# EasyEDA schematic Schematic.json

## Sheets
1 BOARD BAWAH: TITLE: BOARD BAWAH; REV: 1.0; Date: 2022-08-04; Sheet: 1/1; Drawn By: Zubair; Company: Universitas Tidar
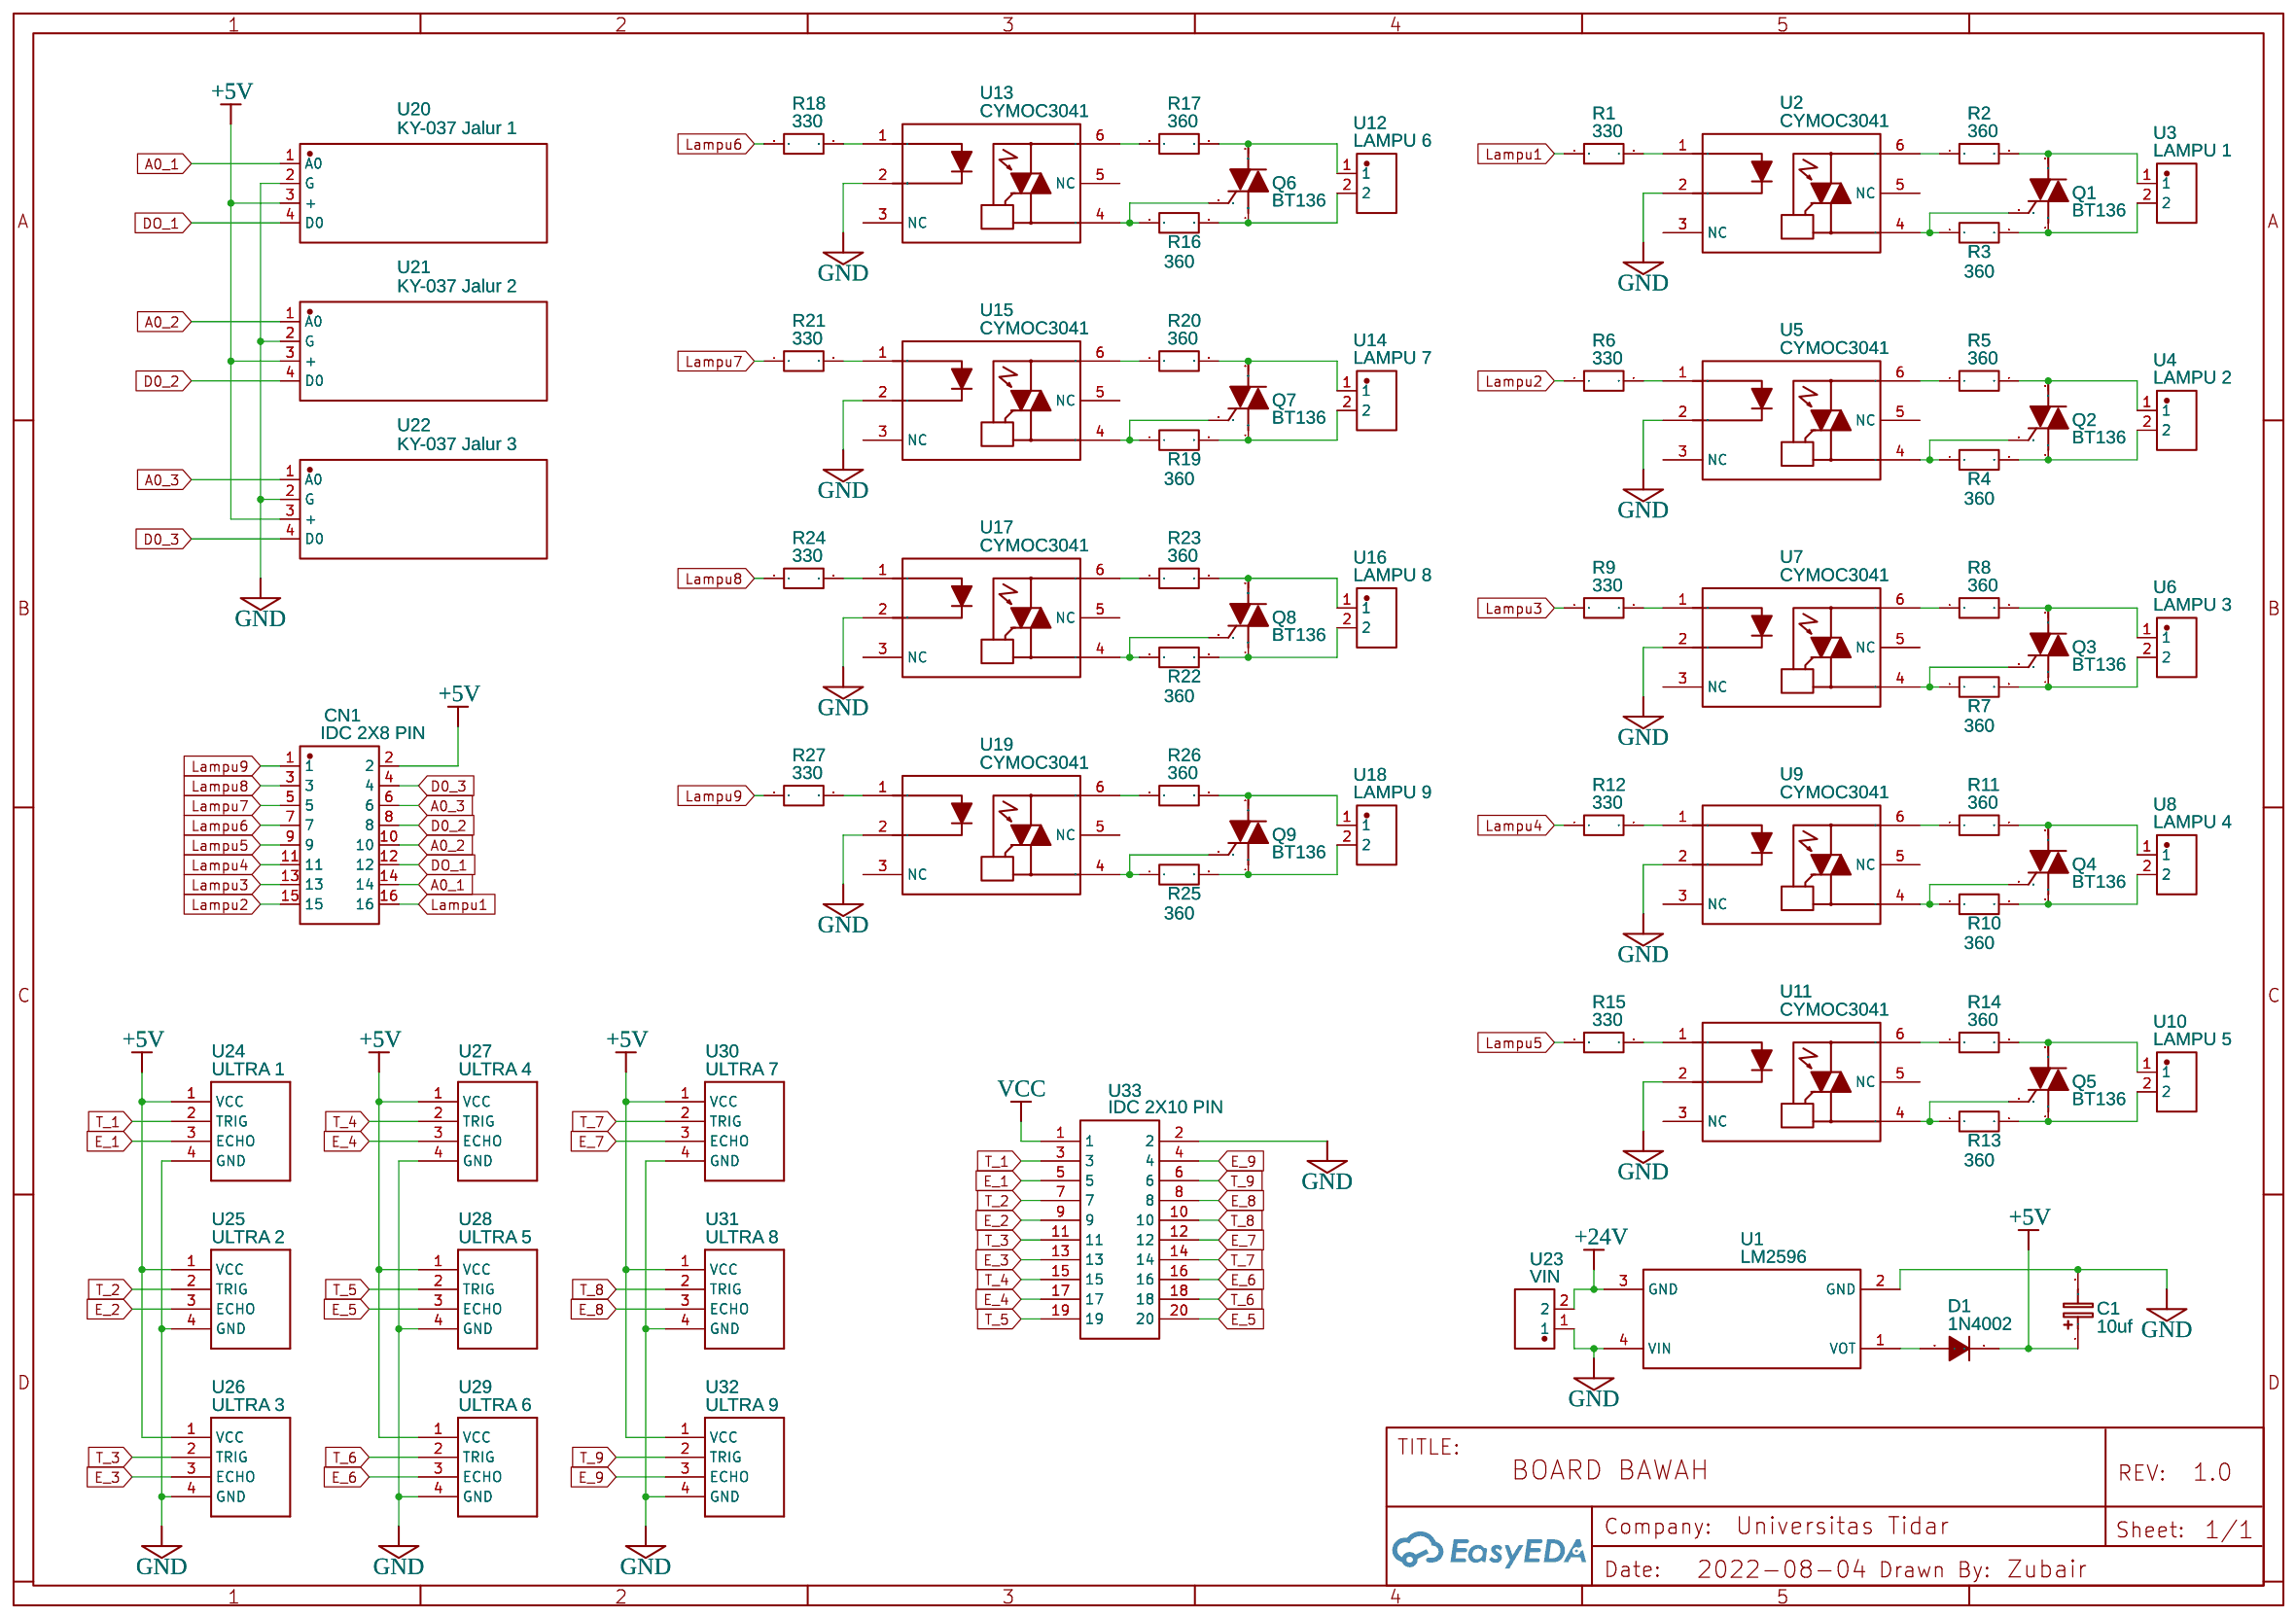
[diagram p0: BOARD BAWAH]
2 BOARD ATAS: TITLE: BOARD ATAS; Date: 2022-09-30
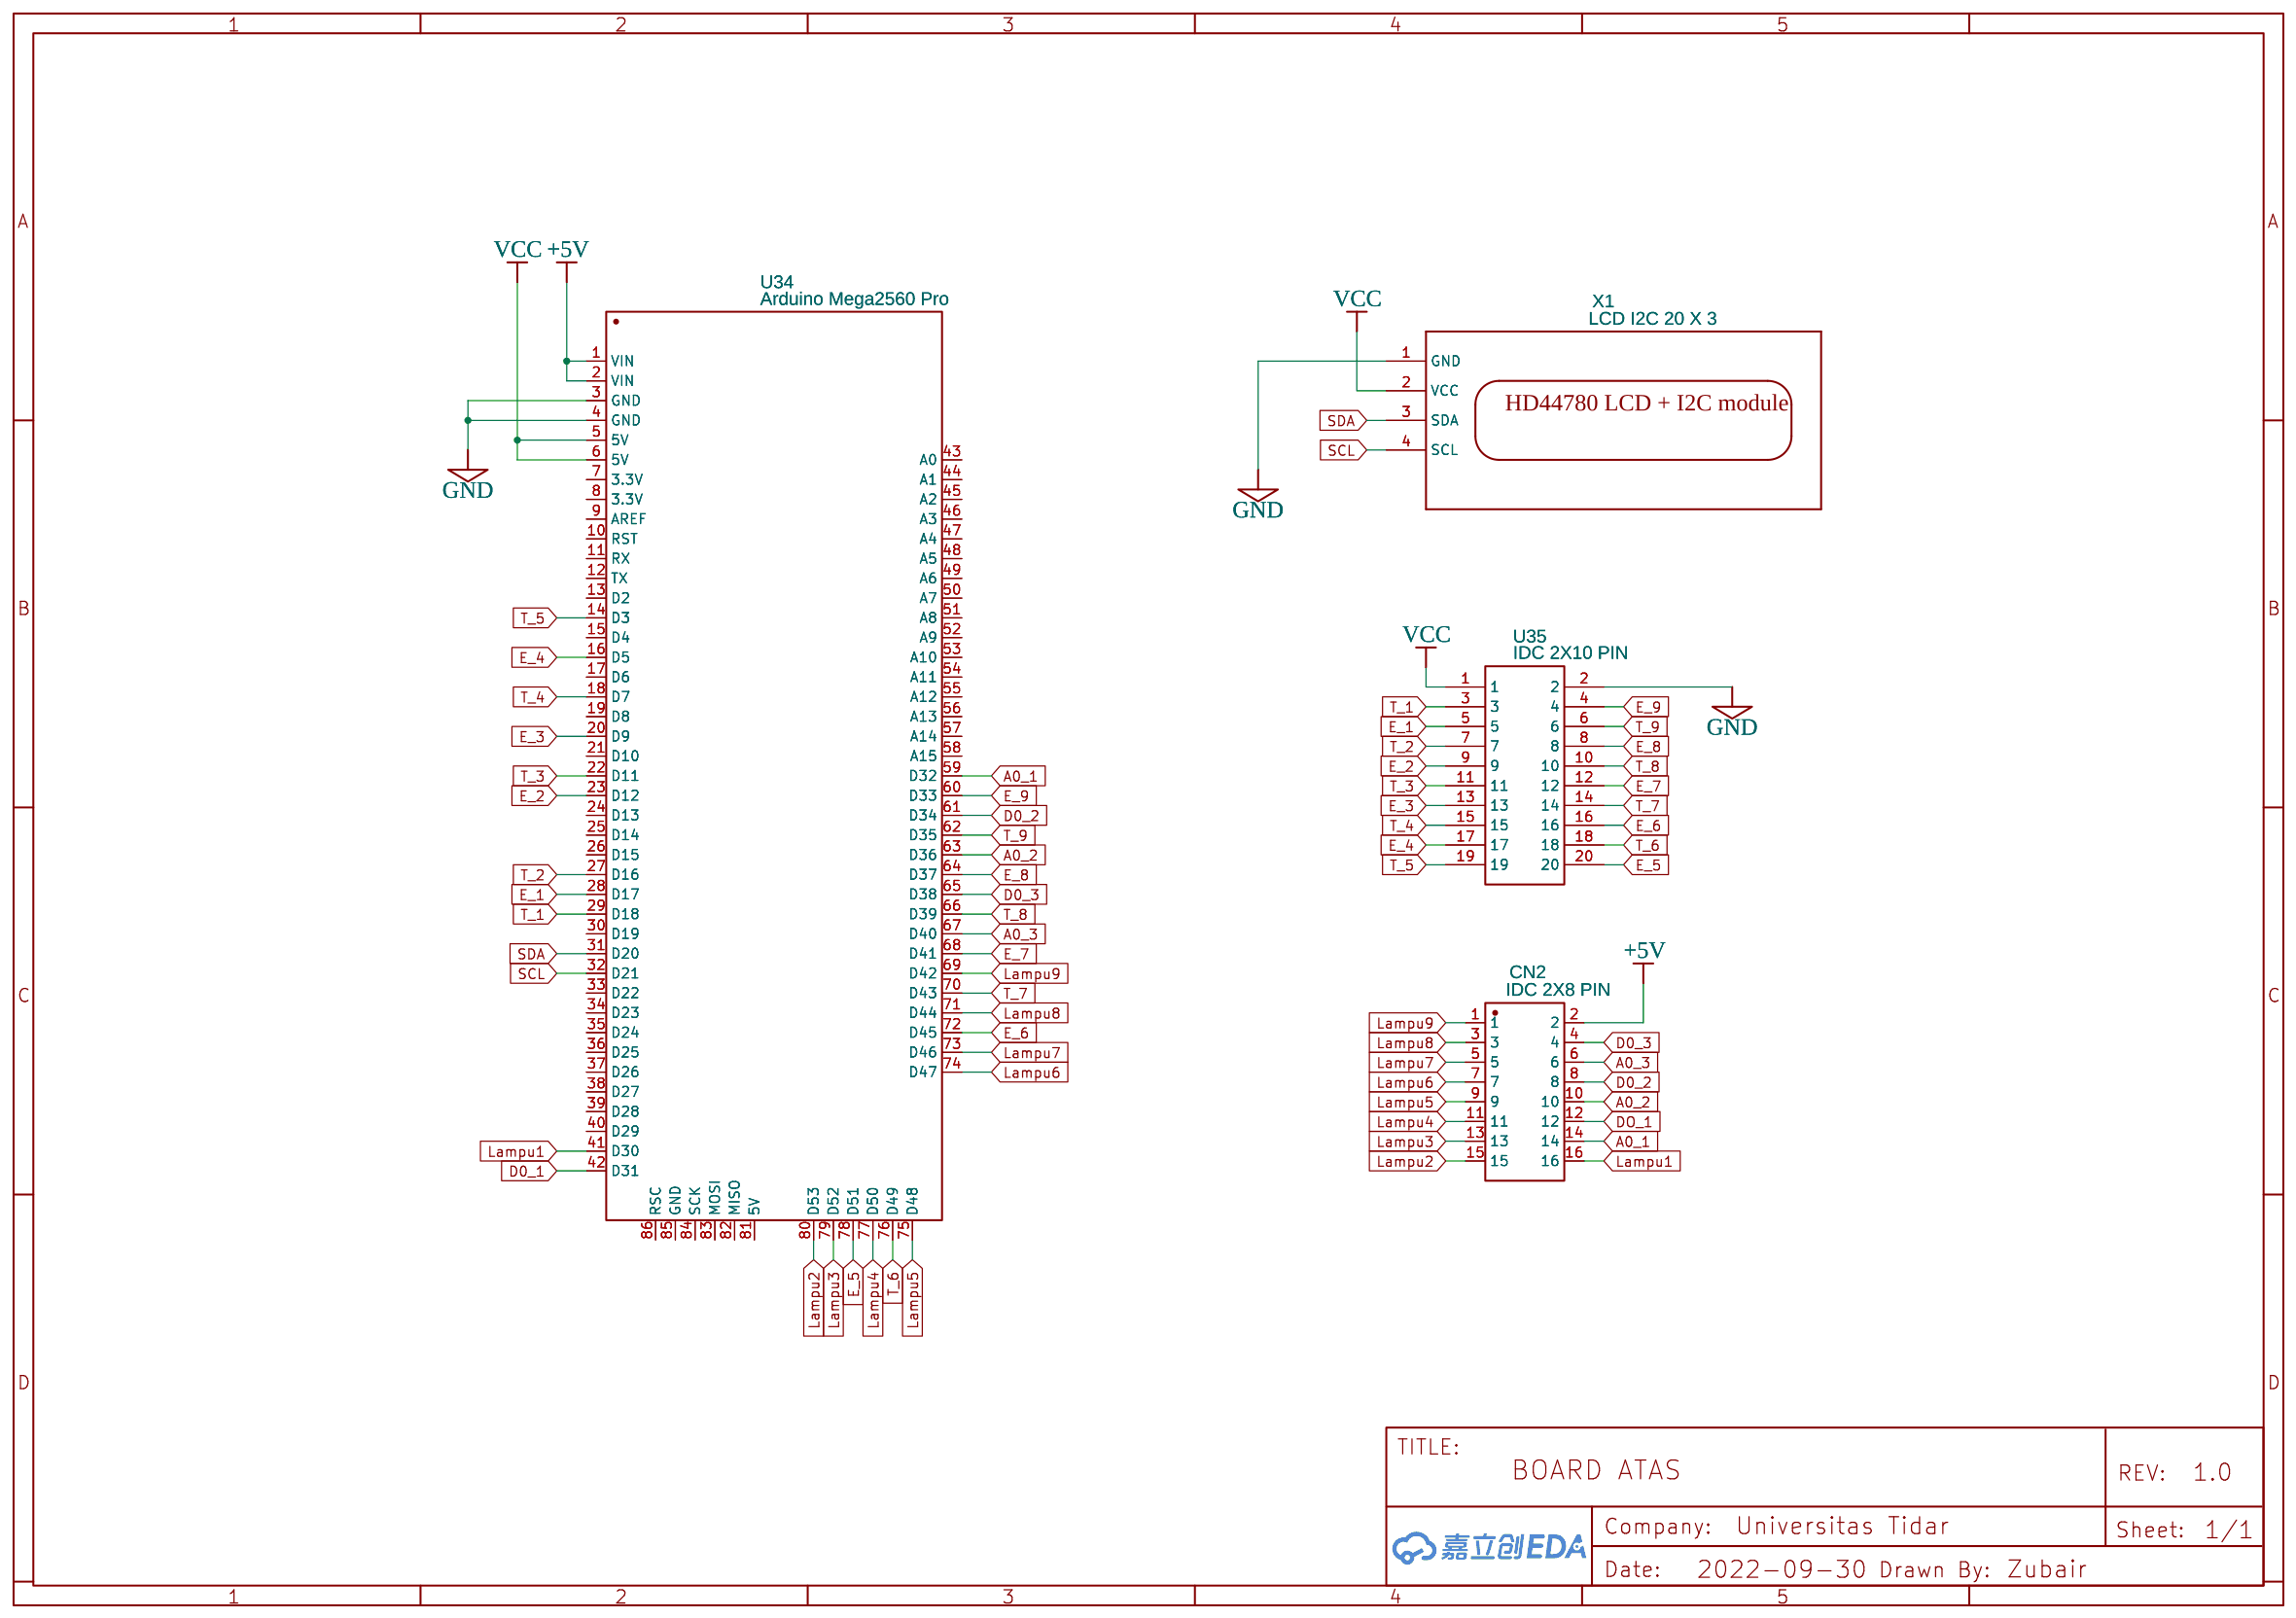
[diagram p1: BOARD ATAS]

## Parts
sheet BOARD ATAS
CN2  IDC 2X8 PIN  [IDC-TH_16P-P2.54_321016RG0ABK00A01]
U34  Arduino Mega2560 Pro  [ARDUINO MEGA2560 PRO]
U35  IDC 2X10 PIN  [IDC-TH_20P-P2.54-V-R2-C10-S2.54]
X1  LCD I2C 20 X 3  [LCD HD44780LCD WITH I2C MODULE]
sheet BOARD BAWAH
C1  10uf  [ELCO PIET]
CN1  IDC 2X8 PIN  [IDC-TH_16P-P2.54_321016RG0ABK00A01]
D1  1N4002  [1N4002]
Q1  BT136  [TO-220-3_L10.0-W4.5-P2.54-T]
Q2  BT136  [TO-220-3_L10.0-W4.5-P2.54-T]
Q3  BT136  [TO-220-3_L10.0-W4.5-P2.54-T]
Q4  BT136  [TO-220-3_L10.0-W4.5-P2.54-T]
Q5  BT136  [TO-220-3_L10.0-W4.5-P2.54-T]
Q6  BT136  [TO-220-3_L10.0-W4.5-P2.54-T]
Q7  BT136  [TO-220-3_L10.0-W4.5-P2.54-T]
Q8  BT136  [TO-220-3_L10.0-W4.5-P2.54-T]
Q9  BT136  [TO-220-3_L10.0-W4.5-P2.54-T]
R1  330  [R0603]
R2  360  [R0603]
R3  360  [R0603]
R4  360  [R0603]
R5  360  [R0603]
R6  330  [R0603]
R7  360  [R0603]
R8  360  [R0603]
R9  330  [R0603]
R10  360  [R0603]
R11  360  [R0603]
R12  330  [R0603]
R13  360  [R0603]
R14  360  [R0603]
R15  330  [R0603]
R16  360  [R0603]
R17  360  [R0603]
R18  330  [R0603]
R19  360  [R0603]
R20  360  [R0603]
R21  330  [R0603]
R22  360  [R0603]
R23  360  [R0603]
R24  330  [R0603]
R25  360  [R0603]
R26  360  [R0603]
R27  330  [R0603]
U1  LM2596  [LM2596]
U2  CYMOC3041  [DIP-6_L7.1-W6.5-P2.54-LS7.6-BL]
U3  LAMPU 1  [CONN-TH_DB128V-7.62-2P-GN-S]
U4  LAMPU 2  [CONN-TH_DB128V-7.62-2P-GN-S]
U5  CYMOC3041  [DIP-6_L7.1-W6.5-P2.54-LS7.6-BL]
U6  LAMPU 3  [CONN-TH_DB128V-7.62-2P-GN-S]
U7  CYMOC3041  [DIP-6_L7.1-W6.5-P2.54-LS7.6-BL]
U8  LAMPU 4  [CONN-TH_DB128V-7.62-2P-GN-S]
U9  CYMOC3041  [DIP-6_L7.1-W6.5-P2.54-LS7.6-BL]
U10  LAMPU 5  [CONN-TH_DB128V-7.62-2P-GN-S]
U11  CYMOC3041  [DIP-6_L7.1-W6.5-P2.54-LS7.6-BL]
U12  LAMPU 6  [CONN-TH_DB128V-7.62-2P-GN-S]
U13  CYMOC3041  [DIP-6_L7.1-W6.5-P2.54-LS7.6-BL]
U14  LAMPU 7  [CONN-TH_DB128V-7.62-2P-GN-S]
U15  CYMOC3041  [DIP-6_L7.1-W6.5-P2.54-LS7.6-BL]
U16  LAMPU 8  [CONN-TH_DB128V-7.62-2P-GN-S]
U17  CYMOC3041  [DIP-6_L7.1-W6.5-P2.54-LS7.6-BL]
U18  LAMPU 9  [CONN-TH_DB128V-7.62-2P-GN-S]
U19  CYMOC3041  [DIP-6_L7.1-W6.5-P2.54-LS7.6-BL]
U20  KY-037 Jalur 1  [KY-037 GERÄUSCHSENSOR]
U21  KY-037 Jalur 2  [KY-037 GERÄUSCHSENSOR]
U22  KY-037 Jalur 3  [KY-037 GERÄUSCHSENSOR]
U23  VIN  [CONN-TH_DB128V-7.62-2P-GN-S]
U24  ULTRA 1  [ULTRASONIC-HC-SR04]
U25  ULTRA 2  [ULTRASONIC-HC-SR04]
U26  ULTRA 3  [ULTRASONIC-HC-SR04]
U27  ULTRA 4  [ULTRASONIC-HC-SR04]
U28  ULTRA 5  [ULTRASONIC-HC-SR04]
U29  ULTRA 6  [ULTRASONIC-HC-SR04]
U30  ULTRA 7  [ULTRASONIC-HC-SR04]
U31  ULTRA 8  [ULTRASONIC-HC-SR04]
U32  ULTRA 9  [ULTRASONIC-HC-SR04]
U33  IDC 2X10 PIN  [IDC-TH_20P-P2.54-V-R2-C10-S2.54]

## Library data of the parts
CN1 CN2 = DW254P-2X8-L0: Supplier: LCSC; Supplier Part: C4749189; Manufacturer: DEALON(德艺隆); Contributor: lcsc
U34 = Arduino Mega2560 Pro: Manufacturer: Arduino; Contributor: artur.japarkulov
U33 U35 = 2*10P牛角插座: Supplier: LCSC; Supplier Part: C9900014220; Manufacturer: null; JLCPCB Part Class: Extended Part; Contributor: lcsc
X1 = SCREEN LCD HD44780LCD WITH I2C MODULE: Contributor: Photon-t
C1 = CE_TH_D5.0×F2.0_EU: Contributor: Oldman2019; Package Display: No
D1 = 1N4002: Contributor: phong031
Q1-Q9 = BT136: Supplier: LCSC; Manufacturer: CJ; Supplier Part: C98796; JLCPCB Part Class: Extended Part
R1-R27 = 贴片电阻CHIPRESISTORS: Supplier: LCSC; Supplier Part: C9900014833; Manufacturer: null; Manufacturer Part: 贴片电阻ChipResistors; link: https://atta.szlcsc.comnull; JLCPCB Part Class: Extended Part; Contributor: lcsc
U1 = LM2596: Contributor: ecrmmwer
U2 U5 U7 U9 U11 U13 U15 U17 U19 = CYMOC3041: Supplier: LCSC; Supplier Part: C3018797; Manufacturer: OCIC(卓睿科); link: https://atta.szlcsc.com/upload/public/pdf/source/20220527/86E767B04E98499F79C6F79C15A909DB.pdf; Contributor: lcsc
U3 U4 U6 U8 U10 U12 U14 U16 U18 U23 = DB128V-7.62-2P-GN-S: Supplier: LCSC; Supplier Part: C2686074; Manufacturer: DIBO(地博电子); Contributor: LCSC; JLCPCB Part Class: Extended Part
U20-U22 = KY-037 Geräuschsensor: Supplier: Bastelgarage; Supplier Part: 420301; link: https://www.bastelgarage.ch/mikrofon-gerauschsensor-ky-037?search=420301; Contributor: Schmedi
U24-U32 = ULTRASONIC-HC-SR04 COPY: Ultrasonic Ranging Module HC-SR04

## Nets
+5V: C1.1 CN1.2 CN2.2 D1.1(K) U20.3(+) U21.3(+) U22.3(+) U24.1(VCC) U25.1(VCC) U26.1(VCC) U27.1(VCC) U28.1(VCC) U29.1(VCC) U30.1(VCC) U31.1(VCC) U32.1(VCC) U34.1(VIN) U34.2(VIN)
+24V: U1.3(GND) U23.2
GND: C1.2 U1.2(GND) U1.4(VIN) U2.2(CAT) U5.2(CAT) U7.2(CAT) U9.2(CAT) U11.2(CAT) U13.2(CAT) U15.2(CAT) U17.2(CAT) U19.2(CAT) U20.2(G) U21.2(G) U22.2(G) U23.1 U24.4(GND) U25.4(GND) U26.4(GND) U27.4(GND) U28.4(GND) U29.4(GND) U30.4(GND) U31.4(GND) U32.4(GND) U33.2 U34.3(GND) U34.4(GND) U35.2 X1.1(GND)
VCC: U33.1 U34.5(5V) U34.6(5V) U35.1 X1.2(VCC)
A0_1: CN1.14 CN2.14 U20.1(A0) U34.59(D32)
A0_2: CN1.10 CN2.10 U21.1(A0) U34.63(D36)
A0_3: CN1.6 CN2.6 U22.1(A0) U34.67(D40)
D0_1: U34.42(D31)
D0_2: CN1.8 CN2.8 U21.4(D0) U34.61(D34)
D0_3: CN1.4 CN2.4 U22.4(D0) U34.65(D38)
DO_1: CN1.12 CN2.12 U20.4(D0)
E_1: U24.3(ECHO) U33.5 U34.28(D17) U35.5
E_2: U25.3(ECHO) U33.9 U34.23(D12) U35.9
E_3: U26.3(ECHO) U33.13 U34.20(D9) U35.13
E_4: U27.3(ECHO) U33.17 U34.16(D5) U35.17
E_5: U28.3(ECHO) U33.20 U34.78(D51) U35.20
E_6: U29.3(ECHO) U33.16 U34.72(D45) U35.16
E_7: U30.3(ECHO) U33.12 U34.68(D41) U35.12
E_8: U31.3(ECHO) U33.8 U34.64(D37) U35.8
E_9: U32.3(ECHO) U33.4 U34.60(D33) U35.4
Lampu1: CN1.16 CN2.16 R1.1 U34.41(D30)
Lampu2: CN1.15 CN2.15 R6.1 U34.80(D53)
Lampu3: CN1.13 CN2.13 R9.1 U34.79(D52)
Lampu4: CN1.11 CN2.11 R12.1 U34.77(D50)
Lampu5: CN1.9 CN2.9 R15.1 U34.75(D48)
Lampu6: CN1.7 CN2.7 R18.1 U34.74(D47)
Lampu7: CN1.5 CN2.5 R21.1 U34.73(D46)
Lampu8: CN1.3 CN2.3 R24.1 U34.71(D44)
Lampu9: CN1.1 CN2.1 R27.1 U34.69(D42)
SCL: U34.32(D21) X1.4(SCL)
SDA: U34.31(D20) X1.3(SDA)
T_1: U24.2(TRIG) U33.3 U34.29(D18) U35.3
T_2: U25.2(TRIG) U33.7 U34.27(D16) U35.7
T_3: U26.2(TRIG) U33.11 U34.22(D11) U35.11
T_4: U27.2(TRIG) U33.15 U34.18(D7) U35.15
T_5: U28.2(TRIG) U33.19 U34.14(D3) U35.19
T_6: U29.2(TRIG) U33.18 U34.76(D49) U35.18
T_7: U30.2(TRIG) U33.14 U34.70(D43) U35.14
T_8: U31.2(TRIG) U33.10 U34.66(D39) U35.10
T_9: U32.2(TRIG) U33.6 U34.62(D35) U35.6
Net-(D1-2): D1.2(A) U1.1(VOT)
Net-(Q1-1): Q1.1(M1) R3.2 U3.2
Net-(Q1-2): Q1.2(M2) R2.2 U3.1
Net-(Q1-3): Q1.3(G) R3.1 U2.4(MT)
Net-(Q2-1): Q2.1(M1) R4.2 U4.2
Net-(Q2-2): Q2.2(M2) R5.2 U4.1
Net-(Q2-3): Q2.3(G) R4.1 U5.4(MT)
Net-(Q3-1): Q3.1(M1) R7.2 U6.2
Net-(Q3-2): Q3.2(M2) R8.2 U6.1
Net-(Q3-3): Q3.3(G) R7.1 U7.4(MT)
Net-(Q4-1): Q4.1(M1) R10.2 U8.2
Net-(Q4-2): Q4.2(M2) R11.2 U8.1
Net-(Q4-3): Q4.3(G) R10.1 U9.4(MT)
Net-(Q5-1): Q5.1(M1) R13.2 U10.2
Net-(Q5-2): Q5.2(M2) R14.2 U10.1
Net-(Q5-3): Q5.3(G) R13.1 U11.4(MT)
Net-(Q6-1): Q6.1(M1) R16.2 U12.2
Net-(Q6-2): Q6.2(M2) R17.2 U12.1
Net-(Q6-3): Q6.3(G) R16.1 U13.4(MT)
Net-(Q7-1): Q7.1(M1) R19.2 U14.2
Net-(Q7-2): Q7.2(M2) R20.2 U14.1
Net-(Q7-3): Q7.3(G) R19.1 U15.4(MT)
Net-(Q8-1): Q8.1(M1) R22.2 U16.2
Net-(Q8-2): Q8.2(M2) R23.2 U16.1
Net-(Q8-3): Q8.3(G) R22.1 U17.4(MT)
Net-(Q9-1): Q9.1(M1) R25.2 U18.2
Net-(Q9-2): Q9.2(M2) R26.2 U18.1
Net-(Q9-3): Q9.3(G) R25.1 U19.4(MT)
Net-(R1-2): R1.2 U2.1(AN)
Net-(R2-1): R2.1 U2.6(MT)
Net-(R5-1): R5.1 U5.6(MT)
Net-(R6-2): R6.2 U5.1(AN)
Net-(R8-1): R8.1 U7.6(MT)
Net-(R9-2): R9.2 U7.1(AN)
Net-(R11-1): R11.1 U9.6(MT)
Net-(R12-2): R12.2 U9.1(AN)
Net-(R14-1): R14.1 U11.6(MT)
Net-(R15-2): R15.2 U11.1(AN)
Net-(R17-1): R17.1 U13.6(MT)
Net-(R18-2): R18.2 U13.1(AN)
Net-(R20-1): R20.1 U15.6(MT)
Net-(R21-2): R21.2 U15.1(AN)
Net-(R23-1): R23.1 U17.6(MT)
Net-(R24-2): R24.2 U17.1(AN)
Net-(R26-1): R26.1 U19.6(MT)
Net-(R27-2): R27.2 U19.1(AN)

Not connected (* = marked no-connect by the designer): U2 3(NC) 5(NC); U5 3(NC) 5(NC); U7 3(NC) 5(NC); U9 3(NC) 5(NC); U11 3(NC) 5(NC); U13 3(NC) 5(NC); U15 3(NC) 5(NC); U17 3(NC) 5(NC); U19 3(NC) 5(NC); U34 7(3.3V) 8(3.3V) 9(AREF) 10(RST) 11(RX) 12(TX) 13(D2) 15(D4) 17(D6) 19(D8) 21(D10) 24(D13) 25(D14) 26(D15) 30(D19) 33(D22) 34(D23) 35(D24) 36(D25) 37(D26) 38(D27) 39(D28) 40(D29) 43(A0) 44(A1) 45(A2) 46(A3) 47(A4) 48(A5) 49(A6) 50(A7) 51(A8) 52(A9) 53(A10) 54(A11) 55(A12) 56(A13) 57(A14) 58(A15) 81(5V) 82(MISO) 83(MOSI) 84(SCK) 85(GND) 86(RSC)
